# EAGLE design sc01a-breakout-board (EAGLE 6.3)
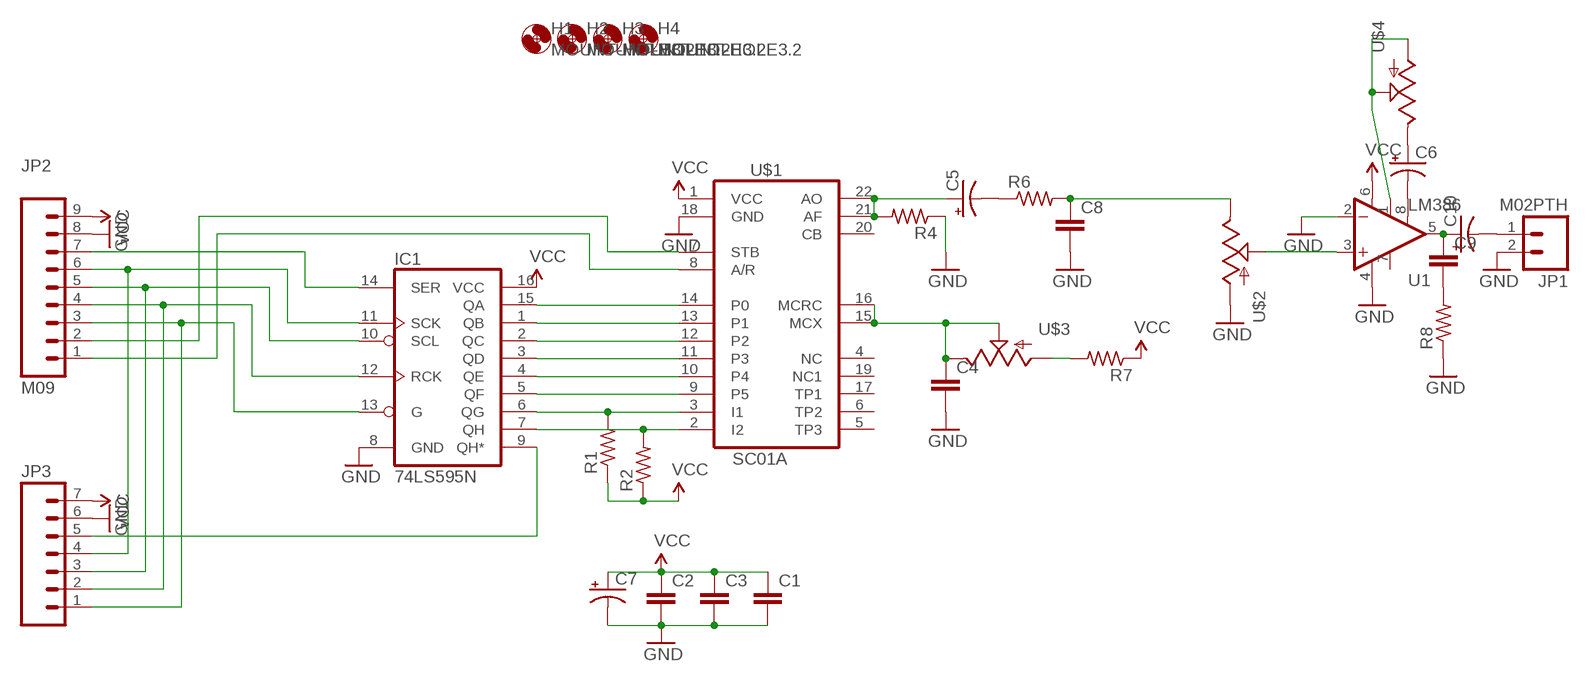
[diagram p0: schematic, sheet 1]

## Parts
C1  CAPEZ  [CAP-PTH-SMALLEZ]
C2  CAPEZ  [CAP-PTH-SMALLEZ]
C3  CAPEZ  [CAP-PTH-SMALLEZ]
C4  CAPEZ  [CAP-PTH-SMALLEZ]
C5  CAP_POLPTH2  [CPOL-RADIAL-10UF-25V]
C6  CAP_POLPTH2  [CPOL-RADIAL-10UF-25V]
C7  CAP_POLPTH2  [CPOL-RADIAL-10UF-25V]
C8  CAPEZ  [CAP-PTH-SMALLEZ]
C9  CAPEZ  [CAP-PTH-SMALLEZ]
C10  CAP_POLPTH2  [CPOL-RADIAL-10UF-25V]
H1  MOUNT-HOLE3.2  [3,2]
H2  MOUNT-HOLE3.2  [3,2]
H3  MOUNT-HOLE3.2  [3,2]
H4  MOUNT-HOLE3.2  [3,2]
IC1  74LS595N  [DIL16]
JP1  M02PTH  [1X02]
JP2  M09  [1X09]
JP3  M07  [1X07]
R1  R-US_0204/5  [0204/5]
R2  R-US_0204/5  [0204/5]
R4  R-US_0204/5  [0204/5]
R6  R-US_0204/5  [0204/5]
R7  R-US_0204/5  [0204/5]
R8  R-US_0204/5  [0204/5]
U1  LM386  [DIP08]
U$1  SC01A  [22PDIP4]
U$2  POTTRIM  [TRIM_POT]
U$3  POTTRIM  [TRIM_POT]
U$4  POTTRIM  [TRIM_POT]

## Nets
GND: C1.2 C2.2 C3.2 C4.2 C7.2(-) C8.2 IC1.8(GND) JP1.2 JP2.8 JP3.6 R4.1 R8.1 U1.2(-IN) U1.4(V-) U$1.18(GND) U$2.3(A)
N$1: IC1.1(QB) U$1.13(P1)
N$2: IC1.2(QC) U$1.12(P2)
N$3: IC1.3(QD) U$1.11(P3)
N$4: IC1.4(QE) U$1.10(P4)
N$5: IC1.5(QF) U$1.9(P5)
N$6: IC1.6(QG) R1.2 U$1.3(I1)
N$7: IC1.7(QH) R2.2 U$1.2(I2)
N$8: IC1.15(QA) U$1.14(P0)
N$9: C5.1(+) R4.2 U$1.21(AF) U$1.22(AO)
N$10: C5.2(-) R6.1
N$11: C8.1 R6.2 U$2.2(E)
N$12: C4.1 U$1.15(MCX) U$1.16(MCRC) U$3.1(S) U$3.2(E)
N$13: R7.2 U$3.3(A)
N$14: JP2.2 U$1.7(STB)
N$15: JP2.1 U$1.8(A/R)
N$16: IC1.9(QH*) JP3.5
N$17: IC1.14(SER) JP2.7
N$18: U1.3(+IN) U$2.1(S)
N$19: C6.2(-) U1.8(GAIN)
N$20: C6.1(+) U$4.2(E)
N$21: U1.1(GAIN) U$4.1(S) U$4.3(A)
N$22: C9.1 C10.1(+) U1.5(OUT)
N$23: C9.2 R8.2
N$24: C10.2(-) JP1.1
N$25: IC1.11(SCK) JP2.6 JP3.4
N$26: IC1.10(SCL) JP2.5 JP3.3
N$27: IC1.12(RCK) JP2.4 JP3.2
N$28: IC1.13(G) JP2.3 JP3.1
VCC: C1.1 C2.1 C3.1 C7.1(+) IC1.16(VCC) JP2.9 JP3.7 R1.1 R2.1 R7.1 U1.6(V+) U$1.1(VCC)
Unconnected: U1.7(BP) U$1.4(NC) U$1.5(TP3) U$1.6(TP2) U$1.17(TP1) U$1.19(NC1) U$1.20(CB)

## Library data of the parts
C1-C4 C8 C9 = SparkFun-Capacitors:CAP: Capacitor Standard 0603 ceramic capacitor, and 0.1" leaded capacitor.
C5-C7 C10 = SparkFun-Passives:CAP_POL: Capacitor Polarized These are standard SMD and PTH capacitors. Normally 10uF, 47uF, and 100uF in electrolytic and tantalum varieties. Always verify the external diameter of the through hole cap, it varies with capacity, voltage, and manufacturer. The EIA devices should be standard.
H1-H4 = holes:MOUNT-HOLE: MOUNTING HOLE with drill center marker
IC1 = SparkFun-DigitalIC:74*595: 8-bit SHIFT REGISTER, output latch
JP1 = SparkFun-Connectors:M02: Standard 2-pin 0.1" header. Use with - straight break away headers ( PRT-00116) - right angle break away headers (PRT-00553) - swiss pins (PRT-00743) - machine pins (PRT-00117) - female headers (PRT-00115) Molex polarized connector foot print use with: PRT-08233 with associated crimp pins and housings. 2.54_SCREWTERM for use with PRT-10571. 3.5mm Screw Terminal footprints for PRT-08084 5mm Screw Terminal footprints for use with PRT-08433
JP2 = SparkFun-Connectors:M09: Header 9 Standard 9-pin 0.1" header. Use with straight break away headers (SKU : PRT-00116), right angle break away headers (PRT-00553), swiss pins (PRT-00743), machine pins (PRT-00117), and female headers (PRT-00115).
JP3 = SparkFun-Connectors:M07: Header 7 Standard 7-pin 0.1" header. Use with straight break away headers (SKU : PRT-00116), right angle break away headers (PRT-00553), swiss pins (PRT-00743), machine pins (PRT-00117), and female headers (PRT-00115). NOTES ON THE VARIANTS LOCK and LOCK_LONGPADS... This footprint was designed to help hold the alignment of a through-hole component (i.e. 7-pin header) while soldering it into place. You may notice that each hole has been shifted either up or down by 0.005 of an inch from it's more standard position (which is usually a perfectly straight line). This slight alteration caused the pins (the squares in the middle) to touch the edges of the holes. Because they are alternating, it causes a "brace" to hold the header in place. 0.005 has proven to be the perfect amount of "off-center" position when using our standard breakaway headers. Although looks a little odd when you look at the bare footprint, once you have a header in there, the alteration is very hard to notice. Also, if you push a header all the way into place, it is covered up entirely on the bottom side. This idea of altering the position of holes to aid alignment will be further integrated into the Sparkfun Library for other footprints. It can help hold any component with 3 or more connection pins.
R1 R2 R4 R6-R8 = adafruit:R-US_: RESISTOR, American symbol
U1 = SparkFun-AnalogIC:LM386: low voltage audio power amplifier
U$1 = voiceChip:SC01A
U$2-U$4 = SparkFun-Electromechanical:POT

## Board
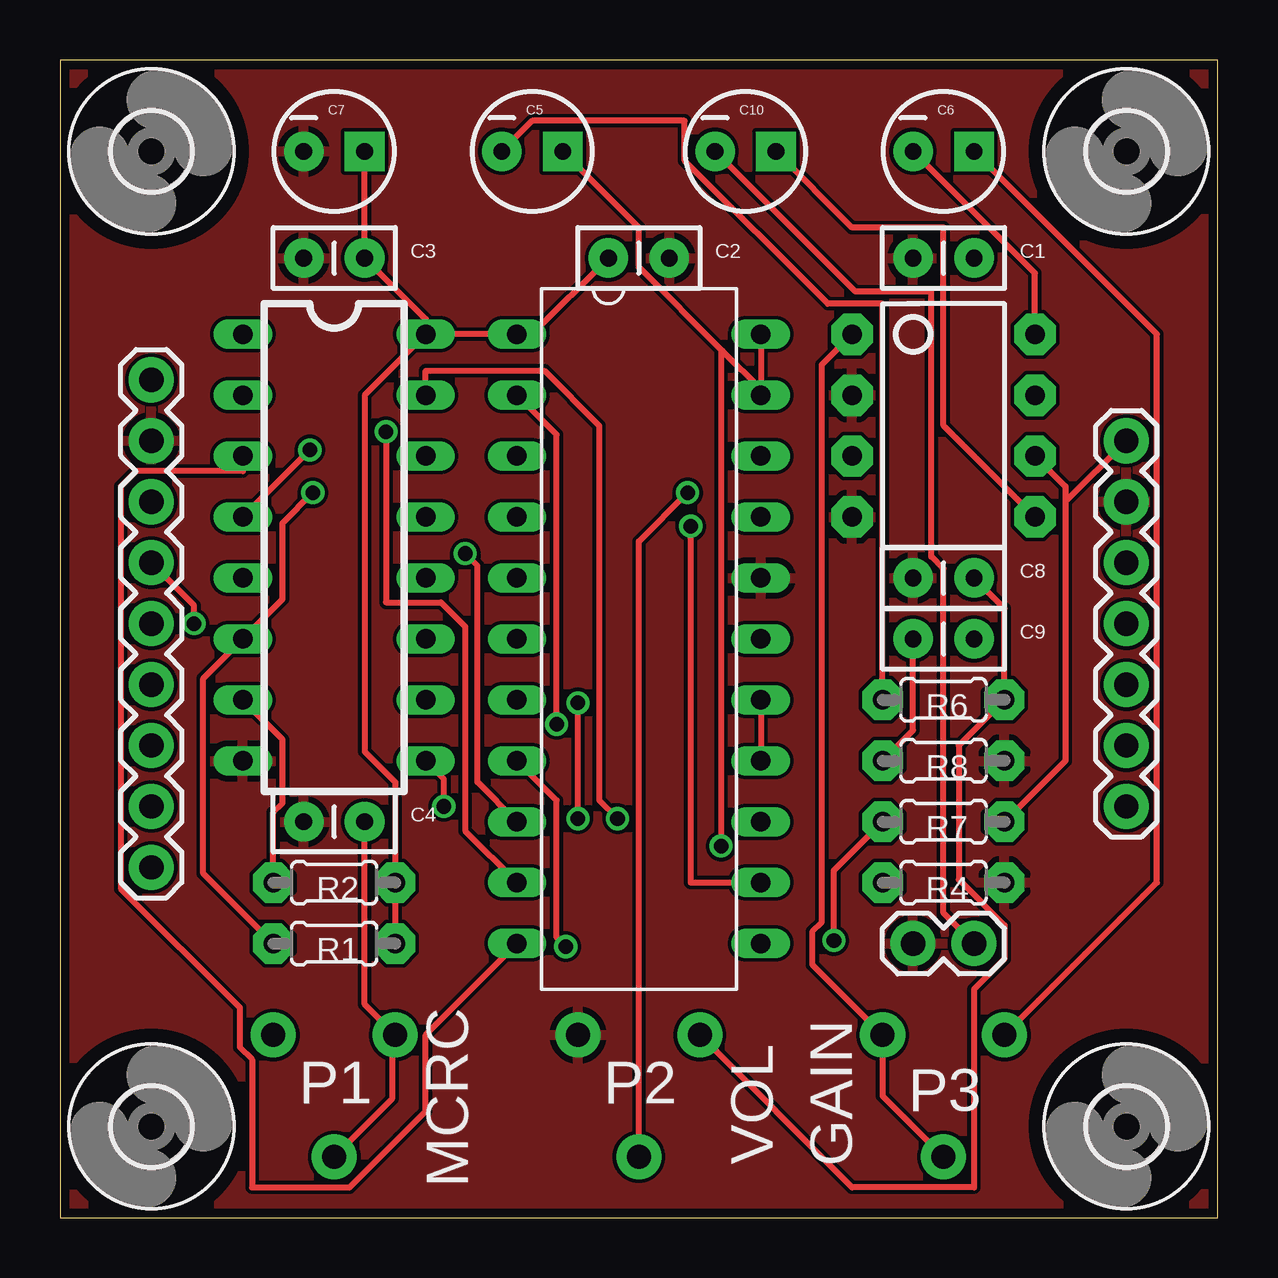
[diagram p1: board, top side]
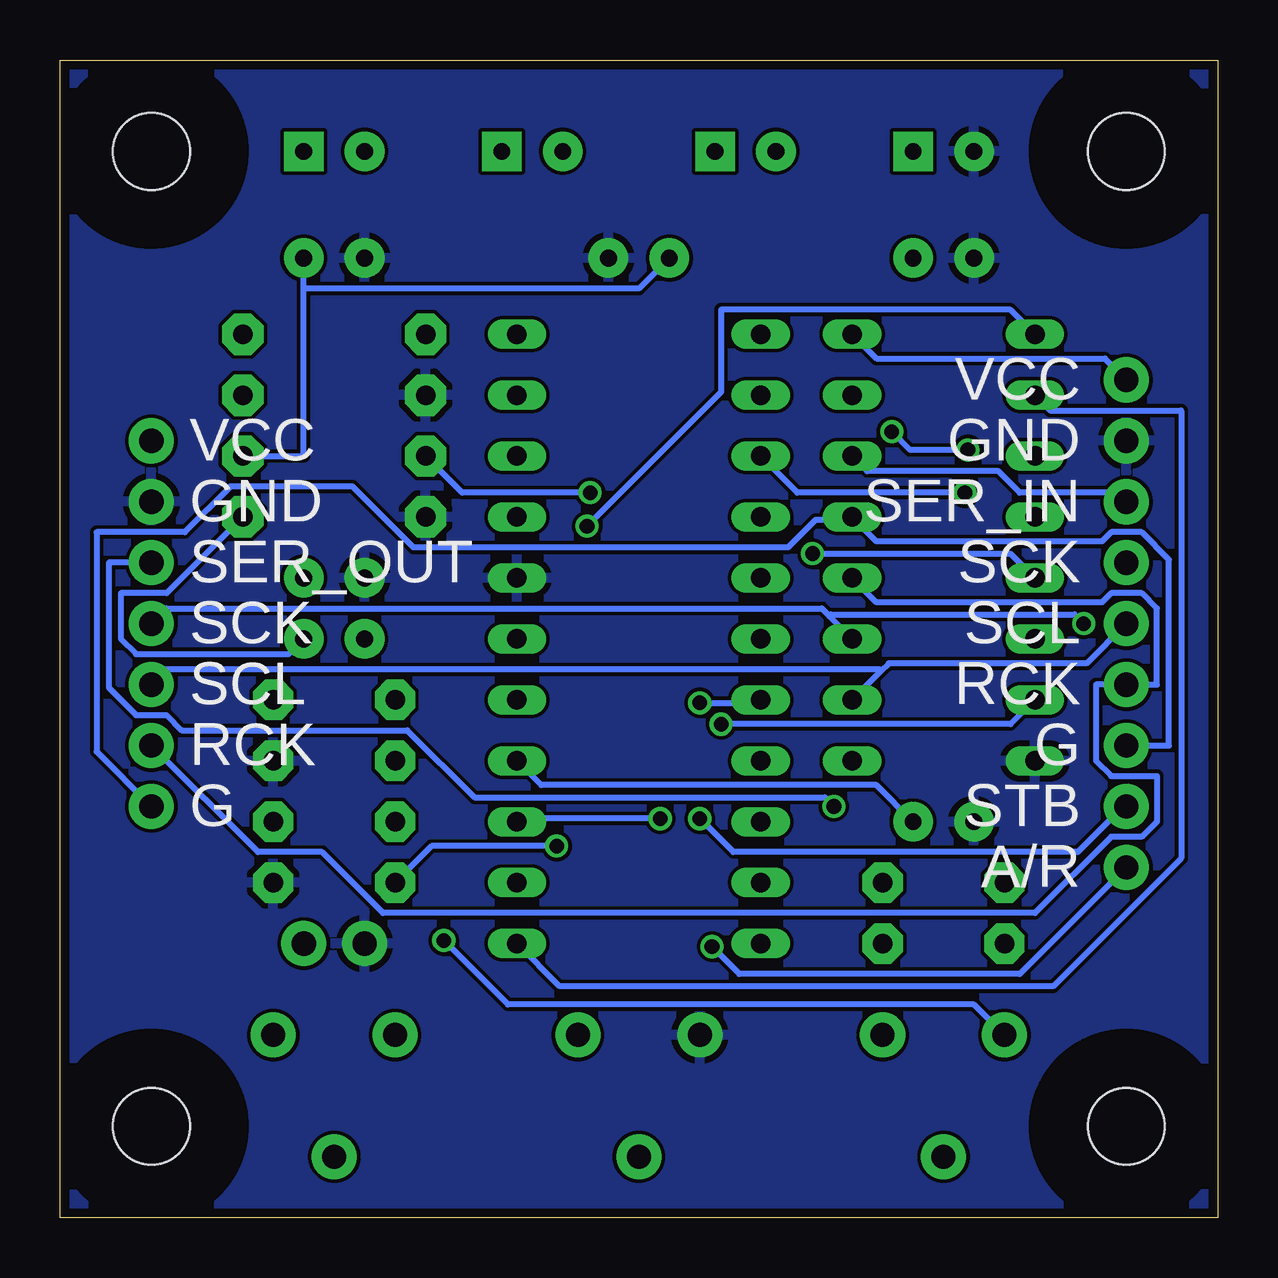
[diagram p2: board, bottom side, seen from below]

Size 48.26 x 48.26 mm. Coordinates in mm from the lower left corner, seen from the top.
Outline: 0,0 48.26,0 48.26,48.26 0,48.26 0,0
Copper layers (1*16): Top 0.0356mm / dielectric 1.5011mm / Bottom 0.0356mm
Design rules "OSHparkPCBorder": minimum track width 6mil, minimum drill 13mil, track to track 6mil, track to pad 6mil, pad to pad 6mil, via to via 6mil, smd to smd 6mil, copper to edge 15mil, drill to drill 6mil, minimum pad ring 7mil, minimum via ring 7mil, stop-mask expansion 3mil, vias tented up to drill 0mil, thermal gap 10mil

### Footprints (pad centres in the part's own frame; a part is rotated, then mirrored left to right if it is on the bottom)
CAP-PTH-SMALLEZ = drill 0.7 pad 1.651: 1 0,0; 2 2.54,0
CPOL-RADIAL-10UF-25V = drill 0.7 pad 1.651 square: 1 1.27,0 | drill 0.7 pad 1.651: 2 -1.27,0
3,2 = hole 3.2: 0,0
DIL16 = drill 0.813 long: 1 -8.89,-3.81; 2 -6.35,-3.81; 3 -3.81,-3.81; 4 -1.27,-3.81; 5 1.27,-3.81; 6 3.81,-3.81; 7 6.35,-3.81; 8 8.89,-3.81; 9 8.89,3.81; 10 6.35,3.81; 11 3.81,3.81; 12 1.27,3.81; 13 -1.27,3.81; 14 -3.81,3.81; 15 -6.35,3.81; 16 -8.89,3.81
1X02 = drill 1.016 pad 1.88: 1 0,0; 2 2.54,0
1X09 = drill 1.016 pad 1.88: 1 0,0; 2 2.54,0; 3 5.08,0; 4 7.62,0; 5 10.16,0; 6 12.7,0; 7 15.24,0; 8 17.78,0; 9 20.32,0
1X07 = drill 1.016 pad 1.88: 1 0,0; 2 2.54,0; 3 5.08,0; 4 7.62,0; 5 10.16,0; 6 12.7,0; 7 15.24,0
0204/5 = drill 0.813 pad 1.676 octagon: 1 -2.54,0; 2 2.54,0
DIP08 = drill 0.813 pad 1.727 octagon: 1 -3.81,-3.81; 2 -1.27,-3.81; 3 1.27,-3.81; 4 3.81,-3.81; 5 3.81,3.81; 6 1.27,3.81; 7 -1.27,3.81; 8 -3.81,3.81
22PDIP4 = drill 0.813 long: 1 -12.7,-5.08; 2 -10.16,-5.08; 3 -7.62,-5.08; 4 -5.08,-5.08; 5 -2.54,-5.08; 6 0,-5.08; 7 2.54,-5.08; 8 5.08,-5.08; 9 7.62,-5.08; 10 10.16,-5.08; 11 12.7,-5.08; 12 12.7,5.08; 13 10.16,5.08; 14 7.62,5.08; 15 5.08,5.08; 16 2.54,5.08; 17 0,5.08; 18 -2.54,5.08; 19 -5.08,5.08; 20 -7.62,5.08; 21 -10.16,5.08; 22 -12.7,5.08
TRIM_POT = drill 1 pad 1.88: 1 5.08,0; 2 0,2.54; 3 0,-2.54

### Placement (x,y rotation side)
C1  38.1,40.01 180 top
C2  22.86,40.01 0 top
C3  12.7,40.01 180 top
C4  12.7,16.51 180 top
C5  19.68,44.45 0 top
C6  36.83,44.45 0 top
C7  11.43,44.45 0 top
C8  38.1,26.67 180 top
C9  38.1,24.13 180 top
C10  28.57,44.45 0 top
H1  3.81,3.81 0 top
H2  3.81,44.45 0 top
H3  44.45,3.81 0 top
H4  44.45,44.45 0 top
IC1  11.43,27.94 270 top
JP1  38.1,11.43 180 top
JP2  3.81,14.61 90 top
JP3  44.45,17.14 90 top
R1  11.43,11.43 180 top
R2  11.43,13.97 180 top
R4  36.83,13.97 180 top
R6  36.83,21.59 0 top
R7  36.83,16.51 180 top
R8  36.83,19.05 180 top
U1  36.83,33.02 270 top
U$1  24.13,24.13 270 top
U$2  24.13,7.62 270 top
U$3  11.43,7.62 270 top
U$4  36.83,7.62 270 top

### Tracks (layer width: path | path; a pad name or v marks a point on that pad's centre or on a via)
GND
  pour Bottom: 0,0 48.26,0 48.26,48.26 0,48.26
  pour Top: 0,0 48.26,0 48.26,48.26 0,48.26
N$1  (via drill 0.61)
  Top 0.254: U$1.13 26.29,13.97 v26.29,28.83
  Bottom 0.254: v26.29,28.83 20.7,34.42 20.7,37.85 8.64,37.85 IC1.1
N$2
  Bottom 0.254: U$1.12 27.43,9.65 6.86,9.65 1.52,14.99 1.52,33.66 6.99,33.66 IC1.2
N$3
  Top 0.254: U$1.11 15.24,7.62 15.24,4.45 12.06,1.27 8,1.27 8,6.6 7.49,7.11 7.49,8.76 2.54,13.72 2.54,30.48 3.17,31.11 7.62,31.11 IC1.3
N$4  (via drill 0.61)
  Top 0.254: U$1.10 16.89,16.13 16.89,24.64 15.88,25.65 13.59,25.65 v13.59,32.77 | IC1.4 v10.41,32
  Bottom 0.254: v13.59,32.77 12.83,32 v10.41,32
N$5  (via drill 0.61)
  Top 0.254: v16.89,27.69 17.4,27.18 17.4,18.16 U$1.9
  Bottom 0.254: IC1.5 8.64,27.69 v16.89,27.69
N$6  (via drill 0.61)
  Top 0.254: R1.2 5.97,14.35 5.97,22.48 IC1.6 9.27,25.78 9.27,28.96 v10.54,30.23
  Bottom 0.254: U$1.3 17.53,30.23 v10.54,30.23
N$7  (via drill 0.61)
  Top 0.254: IC1.7 9.27,19.94 9.27,17.27 8.89,16.89 R2.2 | U$1.2 20.7,32.64 v20.7,20.57
  Bottom 0.254: v20.7,20.57 8.64,20.57 IC1.7
N$8  (via drill 0.61)
  Top 0.254: v23.24,16.64 22.48,17.4 22.48,33.02 20.19,35.31 15.24,35.31 IC1.15
  Bottom 0.254: U$1.14 29.08,16.64 v23.24,16.64
N$9  (via drill 0.61)
  Top 0.254: U$1.22 29.21,34.54 | C5.1 24.13,41.27 24.13,39.62 27.62,36.13 | 29.21,34.54 27.62,36.13 | 29.21,34.54 U$1.21 | v27.56,15.49 27.56,36.07 27.62,36.13
  Bottom 0.254: R4.2 32.77,15.49 v27.56,15.49
N$10
  Top 0.254: C5.2 19.68,45.72 26.04,45.72 26.04,44.07 32,38.1 34.29,38.1 R6.1
N$11
  Top 0.254: C8.1 39.37,25.4 R6.2 37.47,19.68 37.47,14.1 39.37,12.19 39.37,10.79 38.1,9.53 38.1,1.27 33.02,1.27 U$2.2
N$12
  Top 0.254: U$1.16 U$1.15 | C4.1 12.7,8.89 U$3.2 13.84,7.62 13.84,4.95 U$3.1
  Bottom 0.254: U$1.15 28.19,18.03 14.22,18.03 C4.1
N$13  (via drill 0.61)
  Top 0.254: R7.2 32.26,14.48 v32.26,11.56
  Bottom 0.254: v32.26,11.56 29.59,8.89 10.16,8.89 U$3.3
N$14  (via drill 0.61)
  Top 0.254: v21.59,16.64 v21.59,21.46
  Bottom 0.254: U$1.7 19.18,21.46 v21.59,21.46 | v21.59,16.64 20.19,15.24 5.84,15.24 3.94,17.14 JP2.2
N$15  (via drill 0.61)
  Top 0.254: U$1.8 20.7,17.4 20.7,11.68 v21.08,11.3
  Bottom 0.254: v21.08,11.3 19.94,10.16 8.26,10.16 JP2.1
N$16  (via drill 0.61)
  Top 0.254: IC1.9 16,18.29 v16,17.14
  Bottom 0.254: v16,17.14 16.38,17.53 30.99,17.53 33.78,20.32 43.18,20.32 43.81,20.95 45.09,20.95 46.23,22.1 46.23,27.3 JP3.5
N$17
  Bottom 0.254: IC1.14 14.61,31.11 9.14,31.11 8.26,30.23 4.19,30.23 JP2.7
N$18  (via drill 0.61)
  Top 0.254: v26.16,30.23 24.13,28.19 U$2.1
  Bottom 0.254: U1.3 31.5,30.23 v26.16,30.23
N$19
  Top 0.254: C6.2 40.64,39.37 U1.8
N$20
  Top 0.254: C6.1 45.72,36.83 45.72,13.97 U$4.2
N$21
  Top 0.254: U1.1 31.75,35.56 31.75,12.32 31.37,11.94 31.37,10.54 U$4.3 34.29,5.08 U$4.1
N$22
  Top 0.254: C10.1 33.02,41.27 36.83,41.27 36.83,33.02 U1.5
  Bottom 0.254: C9.1 38.73,23.5 45.09,23.5 45.72,24.13 45.72,26.04 43.81,26.04 U1.5
N$23
  Top 0.254: C9.2 35.56,20.32 R8.2
N$24
  Top 0.254: C10.2 33.15,38.61 36.32,38.61 36.32,27.56 36.83,27.05 36.83,12.7 JP1.1
N$25  (via drill 0.61)
  Top 0.254: JP2.6 5.59,25.53 v5.59,24.77
  Bottom 0.254: 16.19,25.08 16.51,25.4 43.81,25.4 JP3.4 | 16.19,25.08 IC1.11 | v5.59,24.77 5.97,25.15 16.13,25.15 16.19,25.08
N$26
  Bottom 0.254: 14.03,22.8 13.72,23.11 5.46,23.11 JP2.5 | 14.03,22.8 IC1.10 | JP3.3 43.81,22.86 14.1,22.86 14.03,22.8
N$27
  Bottom 0.254: IC1.12 14.22,25.65 4.83,25.65 4.45,26.04 3.17,26.04 2.54,25.4 2.54,22.23 JP2.4 5.08,22.23 5.08,19.05 4.45,18.41 2.54,18.41 2.54,16.51 3.17,15.88 4.45,15.88 7.62,12.7 34.8,12.7 37.34,15.24 40.01,15.24 JP3.2
N$28
  Bottom 0.254: JP2.3 2.03,19.68 2.03,27.43 3.17,28.57 4.45,28.57 4.83,28.19 14.22,28.19 IC1.13 15.24,29.08 16.76,29.08 17.91,27.94 33.53,27.94 36.07,30.48 41.15,30.48 43.05,28.57 46.74,28.57 46.74,19.43 JP3.1
VCC
  Top 0.254: R7.1 41.91,19.05 41.91,29.84 | 41.91,29.84 41.91,30.48 U1.6 | 41.91,29.84 JP3.7 | R1.1 R2.1 13.97,18.16 12.7,19.43 12.7,34.29 IC1.16 | IC1.16 U$1.1 19.68,36.83 C2.1 | IC1.16 15.24,37.47 C3.1 C7.1
  Bottom 0.254: 38.1,38.73 38.1,31.75 U1.6 | 38.1,38.73 C1.1 | JP2.9 4.7,35.81 14.22,35.81 IC1.16 | 38.1,38.73 24.13,38.73 C2.1

### Text on the board
tNames: GAIN | P1 | P2 | P3 | VOL | MCRC
bNames: VCC | GND | VCC | SER_IN | GND | SCK | SER_OUT | SCL | SCK | RCK | SCL | G | RCK | STB | G | A/R